# EAGLE design ExternSensors (EAGLE 9.5.0)

## Sheet 1 of 2
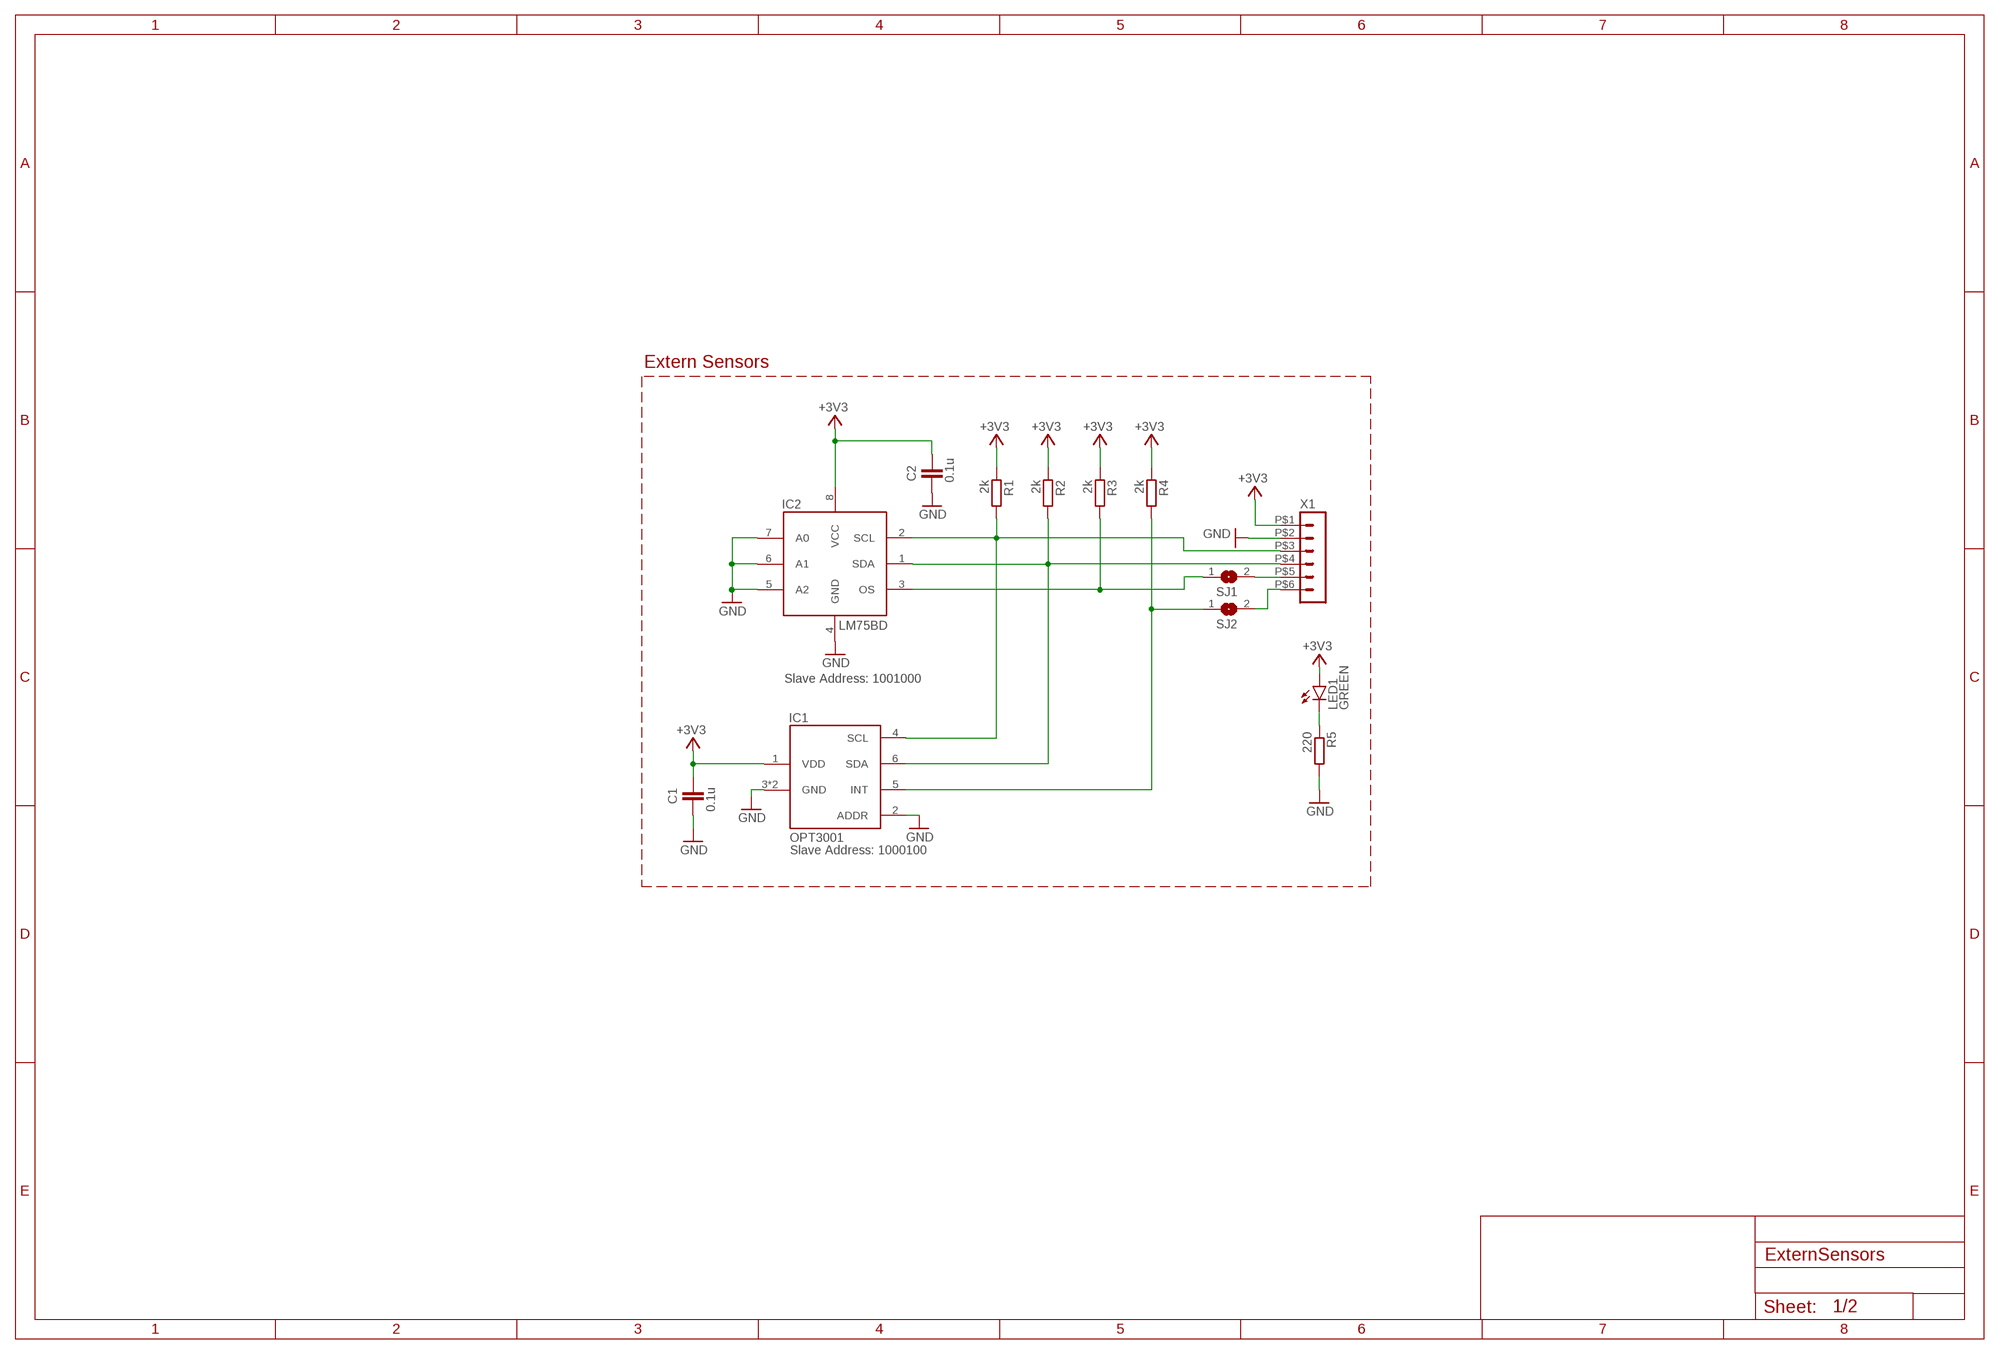
[diagram p0: schematic, sheet 1]

### Parts
C1  0.1u  C-EUC0805K  [C0805K]
C2  0.1u  C-EUC0805K  [C0805K]
IC1  OPT3001  [OPT3001]
IC2  LM75BD  LM75_ICN  [SO8_LM75]
LED1  GREEN  LEDCHIP-LED0805  [CHIP-LED0805]
R1  2k  R-EU_R0805  [R0805]
R2  2k  R-EU_R0805  [R0805]
R3  2k  R-EU_R0805  [R0805]
R4  2k  R-EU_R0805  [R0805]
R5  220  R-EU_R0805  [R0805]
SJ1  SJ  [SJ]
SJ2  SJ  [SJ]
X1  HEADER_POS6_43650-0612  [43650-0612]

### Nets
+3V3: C1.2 C2.2 IC1.1(VDD) IC2.8(VCC) LED1.A R1.1 R2.1 R3.1 R4.1 X1.P$1
GND: C1.1 C2.1 IC1.2(ADDR) IC1.3(GND) IC1.P$1(GND) IC2.4(GND) IC2.5(A2) IC2.6(A1) IC2.7(A0) R5.2 X1.P$2
N$1: LED1.C R5.1
N$2: SJ2.2 X1.P$6
N$24: IC2.3(OS) R3.2 SJ1.1
N$25: IC1.5(INT) R4.2 SJ2.1
N$26: SJ1.2 X1.P$5
SCL: IC1.4(SCL) IC2.2(SCL) R1.2 X1.P$3
SDA: IC1.6(SDA) IC2.1(SDA) R2.2 X1.P$4

### Notes on the sheet
- Extern Sensors
- Slave Address: 1001000
- Slave Address: 1000100

## Sheet 2 of 2

## Library data of the parts
C1 C2 = rcl:C-EU: CAPACITOR, European symbol; SPICEPREFIX: C
IC1 = opt3001:OPT3001: OPT3001 Ambient Light Sensor Texas Instruments
IC2 = lm75:LM75_IC: Temperatursensor
LED1 = led:LED: LED OSRAM: - CHIPLED LG R971, LG N971, LY N971, LG Q971, LY Q971, LO R971, LY R971 LH N974, LH R974 LS Q976, LO Q976, LY Q976 LO Q996 - Hyper CHIPLED LW Q18S LB Q993, LB Q99A, LB R99A - SideLED LS A670, LO A670, LY A670, LG A670, LP A670 LB A673, LV A673, LT A673, LW A673 LH A674 LY A675 LS A676, LA A676, LO A676, LY A676, LW A676 LS A679, LY A679, LG A679 - Hyper Micro SIDELED® LS Y876, LA Y876, LO Y876, LY Y876 LT Y87S - SmartLED LW L88C, LW L88S LB L89C, LB L89S, LG L890 LS L89K, LO L89K, LY L89K LS L896, LA L896, LO L896, LY L896 - TOPLED LS T670, LO T670, LY T670, LG T670, LP T670 LSG T670, LSP T670, LSY T670, LOP T670, LYG T670 LG T671, LOG T671, LSG T671 LB T673, LV T673, LT T673, LW T673 LH T674 LS T676, LA T676, LO T676, LY T676, LB T676, LH T676, LSB T676, LW T676 LB T67C, LV T67C, LT T67C, LS T67K, LO T67K, LY T67K, LW E67C LS E67B, LA E67B, LO E67B, LY E67B, LB E67C, LV E67C, LT E67C LW T67C LS T679, LY T679, LG T679 LS T770, LO T770, LY T770, LG T770, LP T770 LB T773, LV T773, LT T773, LW T773 LH T774 LS E675, LA E675, LY E675, LS T675 LS T776, LA T776, LO T776, LY T776, LB T776 LHGB T686 LT T68C, LB T68C - Hyper Mini TOPLED® LB M676 - Mini TOPLED Santana® LG M470 LS M47K, LO M47K, LY M47K Source: http://www.osram.convergy.de LUXEON: - LUMILED® LXK2-PW12-R00, LXK2-PW12-S00, LXK2-PW14-U00, LXK2-PW14-V00 LXK2-PM12-R00, LXK2-PM12-S00, LXK2-PM14-U00 LXK2-PE12-Q00, LXK2-PE12-R00, LXK2-PE12-S00, LXK2-PE14-T00, LXK2-PE14-U00 LXK2-PB12-K00, LXK2-PB12-L00, LXK2-PB12-M00, LXK2-PB14-N00, LXK2-PB14-P00, LXK2-PB14-Q00 LXK2-PR12-L00, LXK2-PR12-M00, LXK2-PR14-Q00, LXK2-PR14-R00 LXK2-PD12-Q00, LXK2-PD12-R00, LXK2-PD12-S00 LXK2-PH12-R00, LXK2-PH12-S00 LXK2-PL12-P00, LXK2-PL12-Q00, LXK2-PL12-R00 Source: www.luxeon.com KINGBRIGHT: KA-3528ASYC Source: www.kingbright.com
R1-R5 = rcl:R-EU_: RESISTOR, European symbol; SPICEPREFIX: R
SJ1 SJ2 = jumper:SJ: SMD solder JUMPER
X1 = con-molex-micro-fit-3_0:HEADER_POS6_?: Molex - Micro-Fit 3.0 Series connector, 3.00mm (0.118") pitch header, 6 positions.

## Board
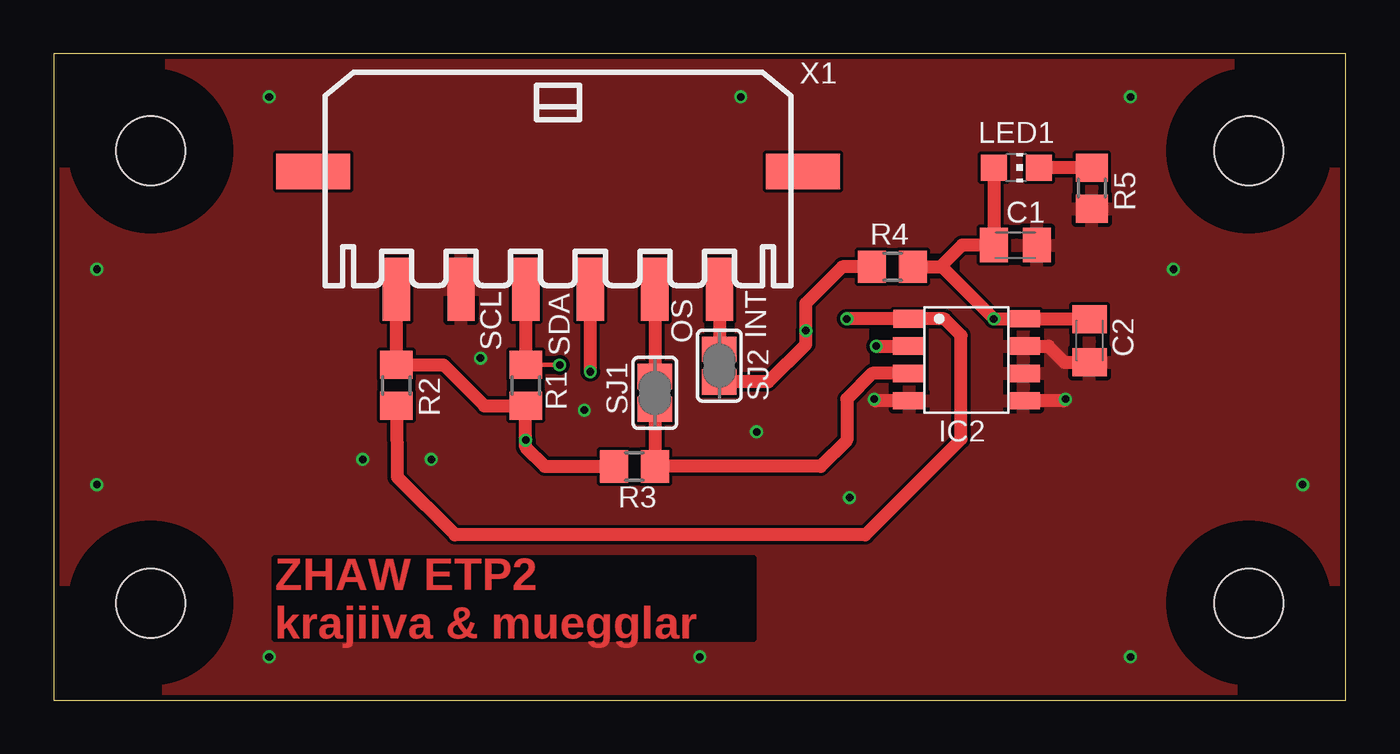
[diagram p1: board, top side]
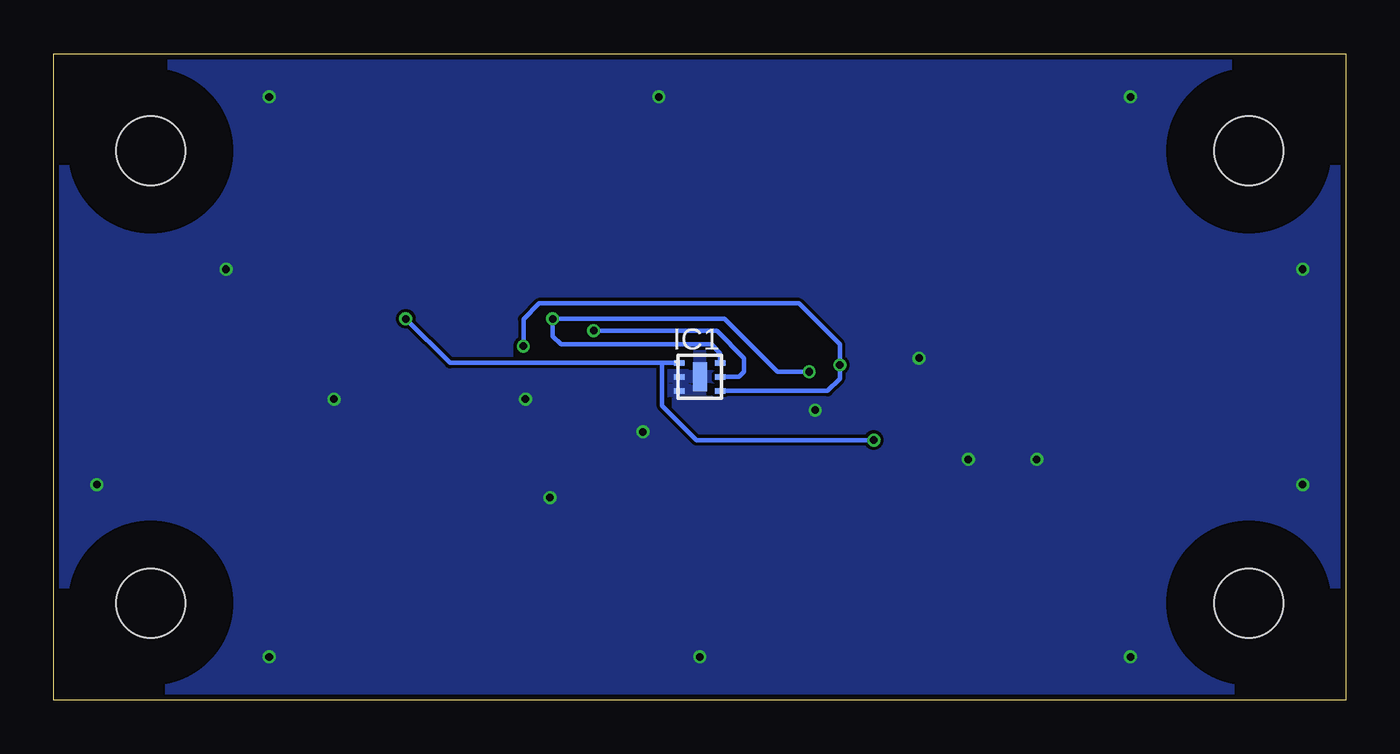
[diagram p2: board, bottom side, seen from below]

Size 60 x 30 mm. Coordinates in mm from the lower left corner, seen from the top.
Outline: 0,0 60,0 60,30 0,30 0,0
Copper layers (1*16): Top 0.018mm / dielectric 1.55mm / Bottom 0.018mm
Design rules "default": minimum track width 0.15mm, minimum drill 0.35mm, track to track 0.15mm, track to pad 0.15mm, pad to pad 0.15mm, via to via 0.15mm, smd to smd 0mil, copper to edge 0.25mm, drill to drill 0.35mm, minimum pad ring 0.175mm, minimum via ring 0.125mm, stop-mask expansion 0mil, vias tented up to drill 0.45mm, thermal gap 0.2mm
Holes 3.2 mm at 4.5,25.5 4.5,4.5 55.5,4.5 55.5,25.5
tRestrict: area 0.8,0.8 to 8.2,8.2; area 0.8,21.8 to 8.2,29.2; area 51.8,21.8 to 59.2,29.2; area 51.8,0.8 to 59.2,8.2
bRestrict: area 0.8,21.8 to 8.2,29.2; area 0.8,0.8 to 8.2,8.2; area 51.8,21.8 to 59.2,29.2; area 51.8,21.8 to 59.2,29.2; area 0.8,21.8 to 8.2,29.2; area 51.8,0.8 to 59.2,8.2; area 0.8,21.8 to 8.2,29.2

### Footprints (pad centres in the part's own frame; a part is rotated, then mirrored left to right if it is on the bottom)
C0805K = smd 1.3 x 1.6: 1 -1,0; 2 1,0
OPT3001 = smd 0.5 x 0.25: 1 -0.95,0.65; 2 -0.95,0; 3 -0.95,-0.65; 4 0.95,-0.65; 5 0.95,0; 6 0.95,0.65 | smd 0.65 x 1.35: P$1 0,0
SO8_LM75 = smd 0.802 x 1.505: 1 -1.905,-2.65; 2 -0.635,-2.65; 3 0.635,-2.65; 4 1.905,-2.65; 5 1.905,2.65; 6 0.635,2.65; 7 -0.635,2.65; 8 -1.905,2.65
CHIP-LED0805 = smd 1.2 x 1.2: A 0,-1.05; C 0,1.05
R0805 = smd 1.3 x 1.5: 1 -0.95,0; 2 0.95,0
SJ = smd 1.168 x 1.6: 1 -0.762,0; 2 0.762,0
43650-0612 = smd 1.27 x 2.92: P$1 7.5,5.48; P$2 4.5,5.48; P$3 1.5,5.48; P$4 -1.5,5.48; P$5 -4.5,5.48; P$6 -7.5,5.48 | smd 3.43 x 1.65: TAB1 11.38,0; TAB2 -11.38,0

### Placement (x,y rotation side)
C1  44.66,21.11 180 top
C2  48.1,16.68 90 top
IC1  30,15 0 bottom
IC2  42.38,15.79 270 top
LED1  44.71,24.72 270 top
R1  21.91,14.61 90 top
R2  15.91,14.61 270 top
R3  26.96,10.84 0 top
R4  38.96,20.11 180 top
R5  48.21,23.77 270 top
SJ1  27.91,14.26 90 top
SJ2  30.91,15.53 90 top
X1  23.41,24.54 180 top

### Tracks (layer width: path | path; a pad name or v marks a point on that pad's centre or on a via)
+3V3  (via drill 0.35)
  Top 0.6: C2.2 48.08,17.7 IC2.8 v43.66,17.7 41.24,20.11 R4.1 41.18,20.11 42.18,21.11 C1.2 LED1.A | R3.1 22.81,10.84 21.91,11.74 v21.91,12.06 R1.1 20,13.65 18.1,15.55 R2.1 X1.P$1
  Bottom 0.2: IC1.1 31.75,15.65 | 31.75,15.65 41.6,15.65 v43.66,17.7 | 31.75,15.65 31.75,13.65 30.16,12.06 v21.91,12.06
GND  (via drill 0.35)
  Top 0.6: IC2.7 46.2,16.43 46.96,15.67 48.08,15.67 C2.1 | IC2.4 38.18,13.89 v38.1,13.97 | v46.99,13.97 46.91,13.89 IC2.5
  other vias: 10,2 30,2 50,2 58,10 52,20 50,28 31.91,28 10,28 2,20 2,10 14.35,11.18 17.53,11.18 32.64,12.45 19.81,15.88 24.64,13.46 36.96,9.4
  pour Top: -0.56,30.61 60.96,30.61 60.96,-0.89 -0.38,-0.89 -1.47,0.2
  pour Bottom: -1.12,30.48 60.83,30.48 60.83,-0.64 -0.25,-0.64 -0.38,-0.76
N$1
  Top 0.6: R5.1 LED1.C
N$2
  Top 0.6: X1.P$6 SJ2.2
N$24
  Top 0.6: IC2.3 38.02,15.16 36.83,13.97 36.83,12.06 35.61,10.84 R3.2 SJ1.1
N$25  (via drill 0.35)
  Top 0.6: R4.2 36.62,20.11 34.92,18.41 v34.92,17.14 34.92,16.51 33.18,14.77 SJ2.1
  Bottom 0.2: IC1.5 28.18,15 27.94,15.24 27.94,15.88 29.21,17.14 v34.92,17.14
N$26
  Top 0.6: X1.P$5 SJ1.2
SCL  (via drill 0.35)
  Top 0.2: R1.2 v23.5,15.55
  Top 0.6: v38.19,16.43 IC2.2 | X1.P$3 R1.2
  Bottom 0.2: v38.19,16.43 38.19,17.69 37.47,18.41 25.4,18.41 23.5,16.51 v23.5,15.55 23.5,14.92 24.07,14.35 IC1.4
SDA  (via drill 0.35)
  Top 0.6: R2.2 15.96,10.35 18.64,7.67 37.69,7.67 42.14,12.12 42.14,16.93 41.37,17.7 IC2.1 v36.83,17.7 | X1.P$4 v24.91,15.24
  Bottom 0.2: v24.91,15.24 26.4,15.24 28.86,17.7 v36.83,17.7 36.83,16.89 36.45,16.51 29.46,16.51 29.05,16.1 IC1.6

### Text on the board
Top: ZHAW ETP2 / krajiiva & muegglar
tNames: X1 | OS | INT | SCL | SDA